# Altium schematic sheet Схема_принципиальная_JY01.SchDoc: Наименование
size 420 x 297 mm; CheckedBy: Гуляев И.А.; Author: Санников А.К.; CompanyName: МГТУ им.Н.Э.Баумана; SheetNumber: 2; SheetTotal: 2; PageSetup: Record=PageOptions|CenterHorizontal=True|CenterVertical=True|PrintScale=0.94|XCorrection=1.00|YCorrection=1.00|PrintKind=1|BorderSize=5000000|LeftOffset=0|BottomOffset=0|Orientation=1|PaperLength=1000|PaperWidth=1000|Scale=100|PaperSource=7|PrintQuality=-4|MediaType=1|DitherType=10|PaperKind=A4|PrintScaleMode=1; DecimalNumber: СМ7.01.01.01; MainDevice: Перв.примен.; Name1: Усилитель мощности; Name2: механизма фиксации; DocumentName: Sheet1.SCHDOC
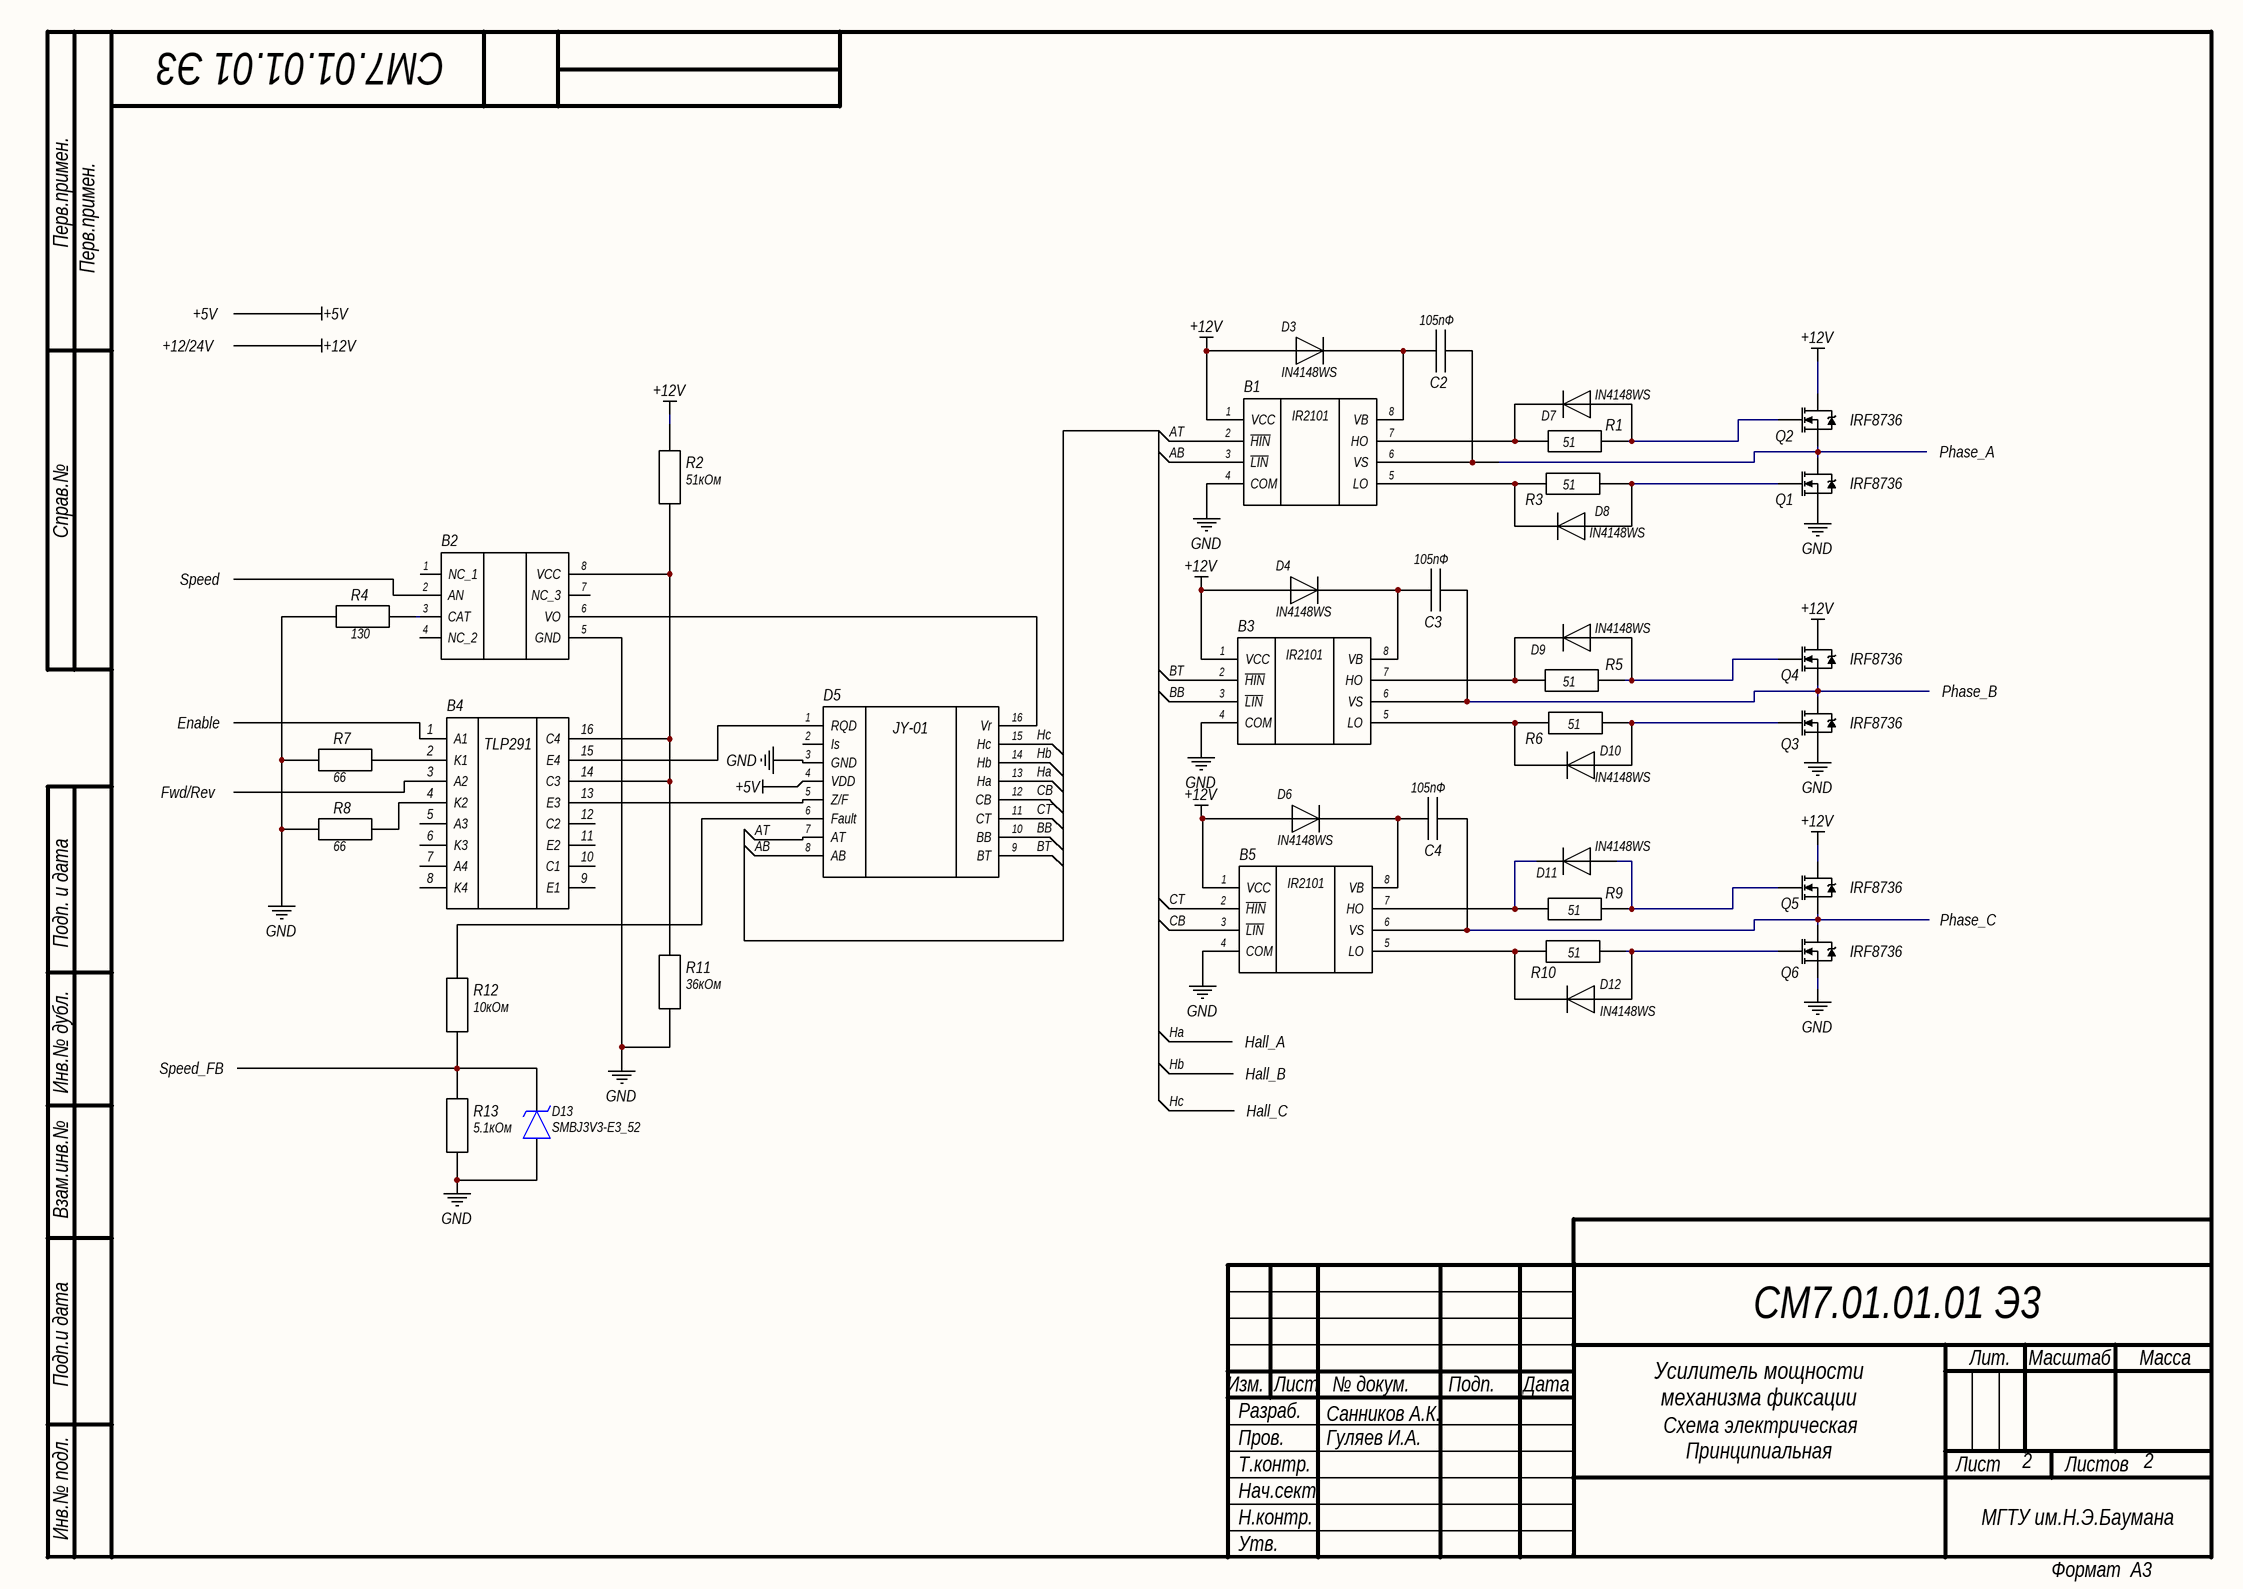
[diagram p0: Схема_принципиальная_JY01.SchDoc]

## Parts
B1  IR2101S  [SOIC127P600X175-8N]  (value not drawn)
B2  HCPL-4504-000E  [DIP762W65P254L965H470Q8N]  (value not drawn)
B3  IR2101S  [SOIC127P600X175-8N]  (value not drawn)
B4  TLP291-4_GB_E_T  [SOIC127P700X220-16N]  (value not drawn)
B5  IR2101S  [SOIC127P600X175-8N]  (value not drawn)
C2  105пФ  [CAPC1608X87N]
C3  105пФ  [CAPC1608X87N]
C4  105пФ  [CAPC1608X87N]
D3  IN4148WS  [SOD2713X115N]
D4  IN4148WS  [SOD2713X115N]
D5  JY01-SOP16  [SOIC127P600X175-16N]  (value not drawn)
D6  IN4148WS  [SOD2713X115N]
D7  IN4148WS  [SOD2713X115N]
D8  IN4148WS  [SOD2713X115N]
D9  IN4148WS  [SOD2713X115N]
D10  IN4148WS  [SOD2713X115N]
D11  IN4148WS  [SOD2713X115N]
D12  IN4148WS  [SOD2713X115N]
D13  SMBJ3V3-E3_52  [DIOM5436X244N]
Q1  IRF8736PBF  [SOIC127P600X175-8N]  (value not drawn)
Q2  IRF8736PBF  [SOIC127P600X175-8N]  (value not drawn)
Q3  IRF8736PBF  [SOIC127P600X175-8N]  (value not drawn)
Q4  IRF8736PBF  [SOIC127P600X175-8N]  (value not drawn)
Q5  IRF8736PBF  [SOIC127P600X175-8N]  (value not drawn)
Q6  IRF8736PBF  [SOIC127P600X175-8N]  (value not drawn)
R1  51  [RESC1608X55N]
R2  51кОм  [RESC1608X55N]
R3  51  [RESC1608X55N]
R4  130  [RESC1608X55N]
R5  51  [RESC1608X55N]
R6  51  [RESC1608X55N]
R7  66  [RESC1608X55N]
R8  66  [RESC1608X55N]
R9  51  [RESC1608X55N]
R10  51  [RESC1608X55N]
R11  36кОм  [RESC1608X55N]
R12  10кОм  [RESC1608X55N]
R13  5.1кОм  [RESC1608X55N]

## Ports
+5V (bidir, see Схема_принципиальная_общая[3A]), +12/24V (bidir, see Схема_принципиальная_общая[3A]), Enable (bidir, see Схема_принципиальная_общая[3A]), Fwd/Rev (bidir, see Схема_принципиальная_общая[3A]), Hall_A (bidir, see Схема_принципиальная_общая[4A]), Hall_B (bidir, see Схема_принципиальная_общая[4A]), Hall_C (bidir, see Схема_принципиальная_общая[4A]), Phase_A (bidir, see Схема_принципиальная_общая[4A]), Phase_B (bidir, see Схема_принципиальная_общая[4A]), Phase_C (bidir, see Схема_принципиальная_общая[4A]), Speed (bidir, see Схема_принципиальная_общая[3A]), Speed_FB (bidir, see Схема_принципиальная_общая[3A])

## Nets
+5V: D5.4(VDD) ; port +5V
+12V: B1.1(VCC) B3.1(VCC) B5.1(VCC) D3.2(A) D4.2(A) D6.2(A) Q2.5,6,7,8(D) Q4.5,6,7,8(D) Q5.5,6,7,8(D) R2.2 ; port +12/24V
GND: B1.4(COM) B2.5(GND) B3.4(COM) B5.4(COM) D5.3(GND) D13.2(A) Q1.1,2,3(S) Q3.1,2,3(S) Q6.1,2,3(S) R4.1 R7.1 R8.1 R11.1 R13.1
AB: B1.3(~{LIN}) D5.8(AB)
AT: B1.2(~{HIN}) D5.7(AT)
BB: B3.3(~{LIN}) D5.10(BB)
BT: B3.2(~{HIN}) D5.9(BT)
CB: B5.3(~{LIN}) D5.12(CB)
CT: B5.2(~{HIN}) D5.11(CT)
Enable: B4.1(A1) ; port Enable
Fwd/Rev: B4.3(A2) ; port Fwd/Rev
Ha: D5.13(Ha) ; port Hall_A
Hb: D5.14(Hb) ; port Hall_B
Hc: D5.15(Hc) ; port Hall_C
Phase_A: B1.6(VS) C2.1 Q1.5,6,7,8(D) Q2.1,2,3(S) ; port Phase_A
Phase_B: B3.6(VS) C3.1 Q3.5,6,7,8(D) Q4.1,2,3(S) ; port Phase_B
Phase_C: B5.6(VS) C4.1 Q5.1,2,3(S) Q6.5,6,7,8(D) ; port Phase_C
Speed: B2.2(AN) ; port Speed
Speed_FB: D13.1(K) R12.1 R13.2 ; port Speed_FB
NetB1_5: B1.5(LO) D8.1(K) R3.1
NetB1_7: B1.7(HO) D7.1(K) R1.1
NetB1_8: B1.8(VB) C2.2 D3.1(K)
NetB2_3: B2.3(CAT) R4.2
NetB2_6: B2.6(VO) D5.16(Vr)
NetB2_8: B2.8(VCC) B4.14(C3) B4.16(C4) R2.1 R11.2
NetB3_5: B3.5(LO) D10.1(K) R6.1
NetB3_7: B3.7(HO) D9.1(K) R5.1
NetB3_8: B3.8(VB) C3.2 D4.1(K)
NetB4_2: B4.2(K1) R7.2
NetB4_4: B4.4(K2) R8.2
NetB4_13: B4.13(E3) D5.5(Z/F)
NetB4_15: B4.15(E4) D5.1(RQD)
NetB5_5: B5.5(LO) D12.1(K) R10.1
NetB5_7: B5.7(HO) D11.1(K) R9.1
NetB5_8: B5.8(VB) C4.2 D6.1(K)
NetD5_6: D5.6(Fault) R12.2
NetD7_2: D7.2(A) Q2.4(G) R1.2
NetD8_2: D8.2(A) Q1.4(G) R3.2
NetD9_2: D9.2(A) Q4.4(G) R5.2
NetD10_2: D10.2(A) Q3.4(G) R6.2
NetD11_2: D11.2(A) Q5.4(G) R9.2
NetD12_2: D12.2(A) Q6.4(G) R10.2

Not connected (* = marked no-connect by the designer): B2 1(NC_1) 4(NC_2) 7(NC_3); B4 5(A3) 6(K3) 7(A4) 8(K4) 9(E1) 10(C1) 11(E2) 12(C2); D5 2(Is)

## Notes on the sheet
- Перв.примен.
- Справ.№
- Подп. и дата
- Инв.№ дубл.
- Взам.инв.№
- Подп.и дата
- Разраб.
- Изм.
- Лист
- № докум.
- Подп.
- Дата
- Лит.
- Масштаб
- Масса
- Т.контр.
- Пров.
- Принципиальная
- Схема электрическая
- Листов
- Инв.№ подл.
- Утв.
- Н.контр.
- Нач.сект.
- Формат  A3
- (in symbol IR2101S) IR2101
- (in symbol IRF8736PBF) IRF8736
- (in symbol JY01-SOP16) JY-01
- (in symbol TLP291-4_GB_E_T) TLP291

## Library data of the parts
B1 B3 B5 = IR2101S: IC GATE DRVR HALF-BRIDGE 8SOIC; Manufacturer_Name: Infineon; Geometry.Height: 1.75mm; Manufacturer_Part_Number: IR2101S; Mouser Part Number: *; Mouser Price/Stock: *; Arrow Part Number: *; Arrow Price/Stock: *; Datasheet Link: https://pdf1.alldatasheet.com/datasheet-pdf/view/102221/IRF/IR2101S.html
B2 = HCPL-4504-000E: Optocoupler, Transistor Output, 1 Channel, DIP, 8 Pins, 25 mA, 3.75 kV, 25 %; Manufacturer_Name: Avago Technologies; Geometry.Height: 4.7mm; Manufacturer_Part_Number: HCPL-4504-000E; Mouser Part Number: 630-HCPL-4504-000E; Mouser Price/Stock: https://www.mouser.co.uk/ProductDetail/Broadcom-Avago/HCPL-4504-000E?qs=s%252BgfxR24RQ6uFOvNhu%252ByDw%3D%3D; Arrow Part Number: *; Arrow Price/Stock: *; Datasheet Link: https://componentsearchengine.com/Datasheets/2/HCPL-4504-000E.pdf
B4 = TLP291-4_GB_E_T: Photocoupler, Tr, 2.3mm, DC, SO16; Manufacturer_Name: Toshiba; Manufacturer_Part_Number: TLP291-4(GB,E(T; Geometry.Height: 2.2mm; Mouser Part Number: *; Mouser Price/Stock: *; Arrow Part Number: TLP291-4(GB,E(T; Arrow Price/Stock: https://www.arrow.com/en/products/tlp291-4-gbe-t/toshiba?region=europe; Datasheet Link: http://toshiba.semicon-storage.com/info/docget.jsp?did=12858&prodName=TLP291-4
C2-C4 = C0603: C 0603; Manufacturer_Name: KEMET; Manufacturer_Part_Number: C0603C222K4REC7411; Geometry.Height: 0.87mm; Mouser Part Number: *; Mouser Price/Stock: *; Arrow Part Number: *; Arrow Price/Stock: *; Datasheet Link: https://www.kemet.com/specsheet/C0603C222K4REC7411
D3 D4 D6-D12 = IN4148WS: Small Signal Fast Switching Diode; Manufacturer_Name: Vishay; Geometry.Height: 1.15mm; Manufacturer_Part_Number: IN4148WS; Mouser Part Number: *; Mouser Price/Stock: *; Arrow Part Number: *; Arrow Price/Stock: *; Datasheet Link: https://docs.rs-online.com/69cb/0900766b80dd2a8d.pdf
D5 = JY01-SOP16: BLDC FOC Controller; Manufacturer_Name: China; Geometry.Height: 1.75mm; Manufacturer_Part_Number: JY01-SOP16; Mouser Part Number: *; Mouser Price/Stock: *; Arrow Part Number: *; Arrow Price/Stock: *; Datasheet Link: http://www.lenzetech.com/public/store/pdf/jsggs/AC6969A%C2%A0Datasheet%C2%A0V1.0.pdf
D13 = SMBJ3V3-E3_52: TVS Diode (Uni-directional); Manufacturer_Name: Vishay; Manufacturer_Part_Number: SMBJ3V3-E3/52; Datasheet Link: http://www.farnell.com/datasheets/2244846.pdf; Height: 2.44mm; Mouser Part Number: 625-SMBJ3V3-E3; Mouser Price/Stock: https://www.mouser.co.uk/ProductDetail/Vishay-General-Semiconductor/SMBJ3V3-E3-52?qs=%252BKsK5HlK7GG3a%2FL90gCz%2Fg%3D%3D; Arrow Part Number: SMBJ3V3-E3/52; Arrow Price/Stock: https://www.arrow.com/en/products/smbj3v3-e352/vishay?region=nac
Q1-Q6 = IRF8736PBF: Infineon IRF8736PBF N-channel MOSFET, 18 A, 30 V HEXFET, 8-Pin SOIC; Geometry.Height: 1.75mm; Manufacturer_Name: Infineon; Manufacturer_Part_Number: IRF8736PBF; Mouser Part Number: 942-IRF8736PBF; Mouser Price/Stock: https://www.mouser.co.uk/ProductDetail/Infineon-IR/IRF8736PBF?qs=Z8%252BeY1k3TII91Qkl2E%252BuQw%3D%3D; Arrow Part Number: IRF8736PBF; Arrow Price/Stock: https://www.arrow.com/en/products/irf8736pbf/infineon-technologies-ag; Datasheet Link: https://www.infineon.com/dgdl/irf8736pbf.pdf?fileId=5546d462533600a40153560d9e661d7f
R1-R13 = R0603: Resistor 0603 Case 150 +/-0.1% 0.063W +/-25ppm/C; Manufacturer_Name: TE Connectivity; Manufacturer_Part_Number: CPF0603B150RE; Geometry.Height: 0.55mm; Mouser Part Number: *; Mouser Price/Stock: *; Arrow Part Number: *; Arrow Price/Stock: *; Datasheet Link: http://www.farnell.com/datasheets/1786775.pdf